# EAGLE schematic plate_template (EAGLE 7.7.0)
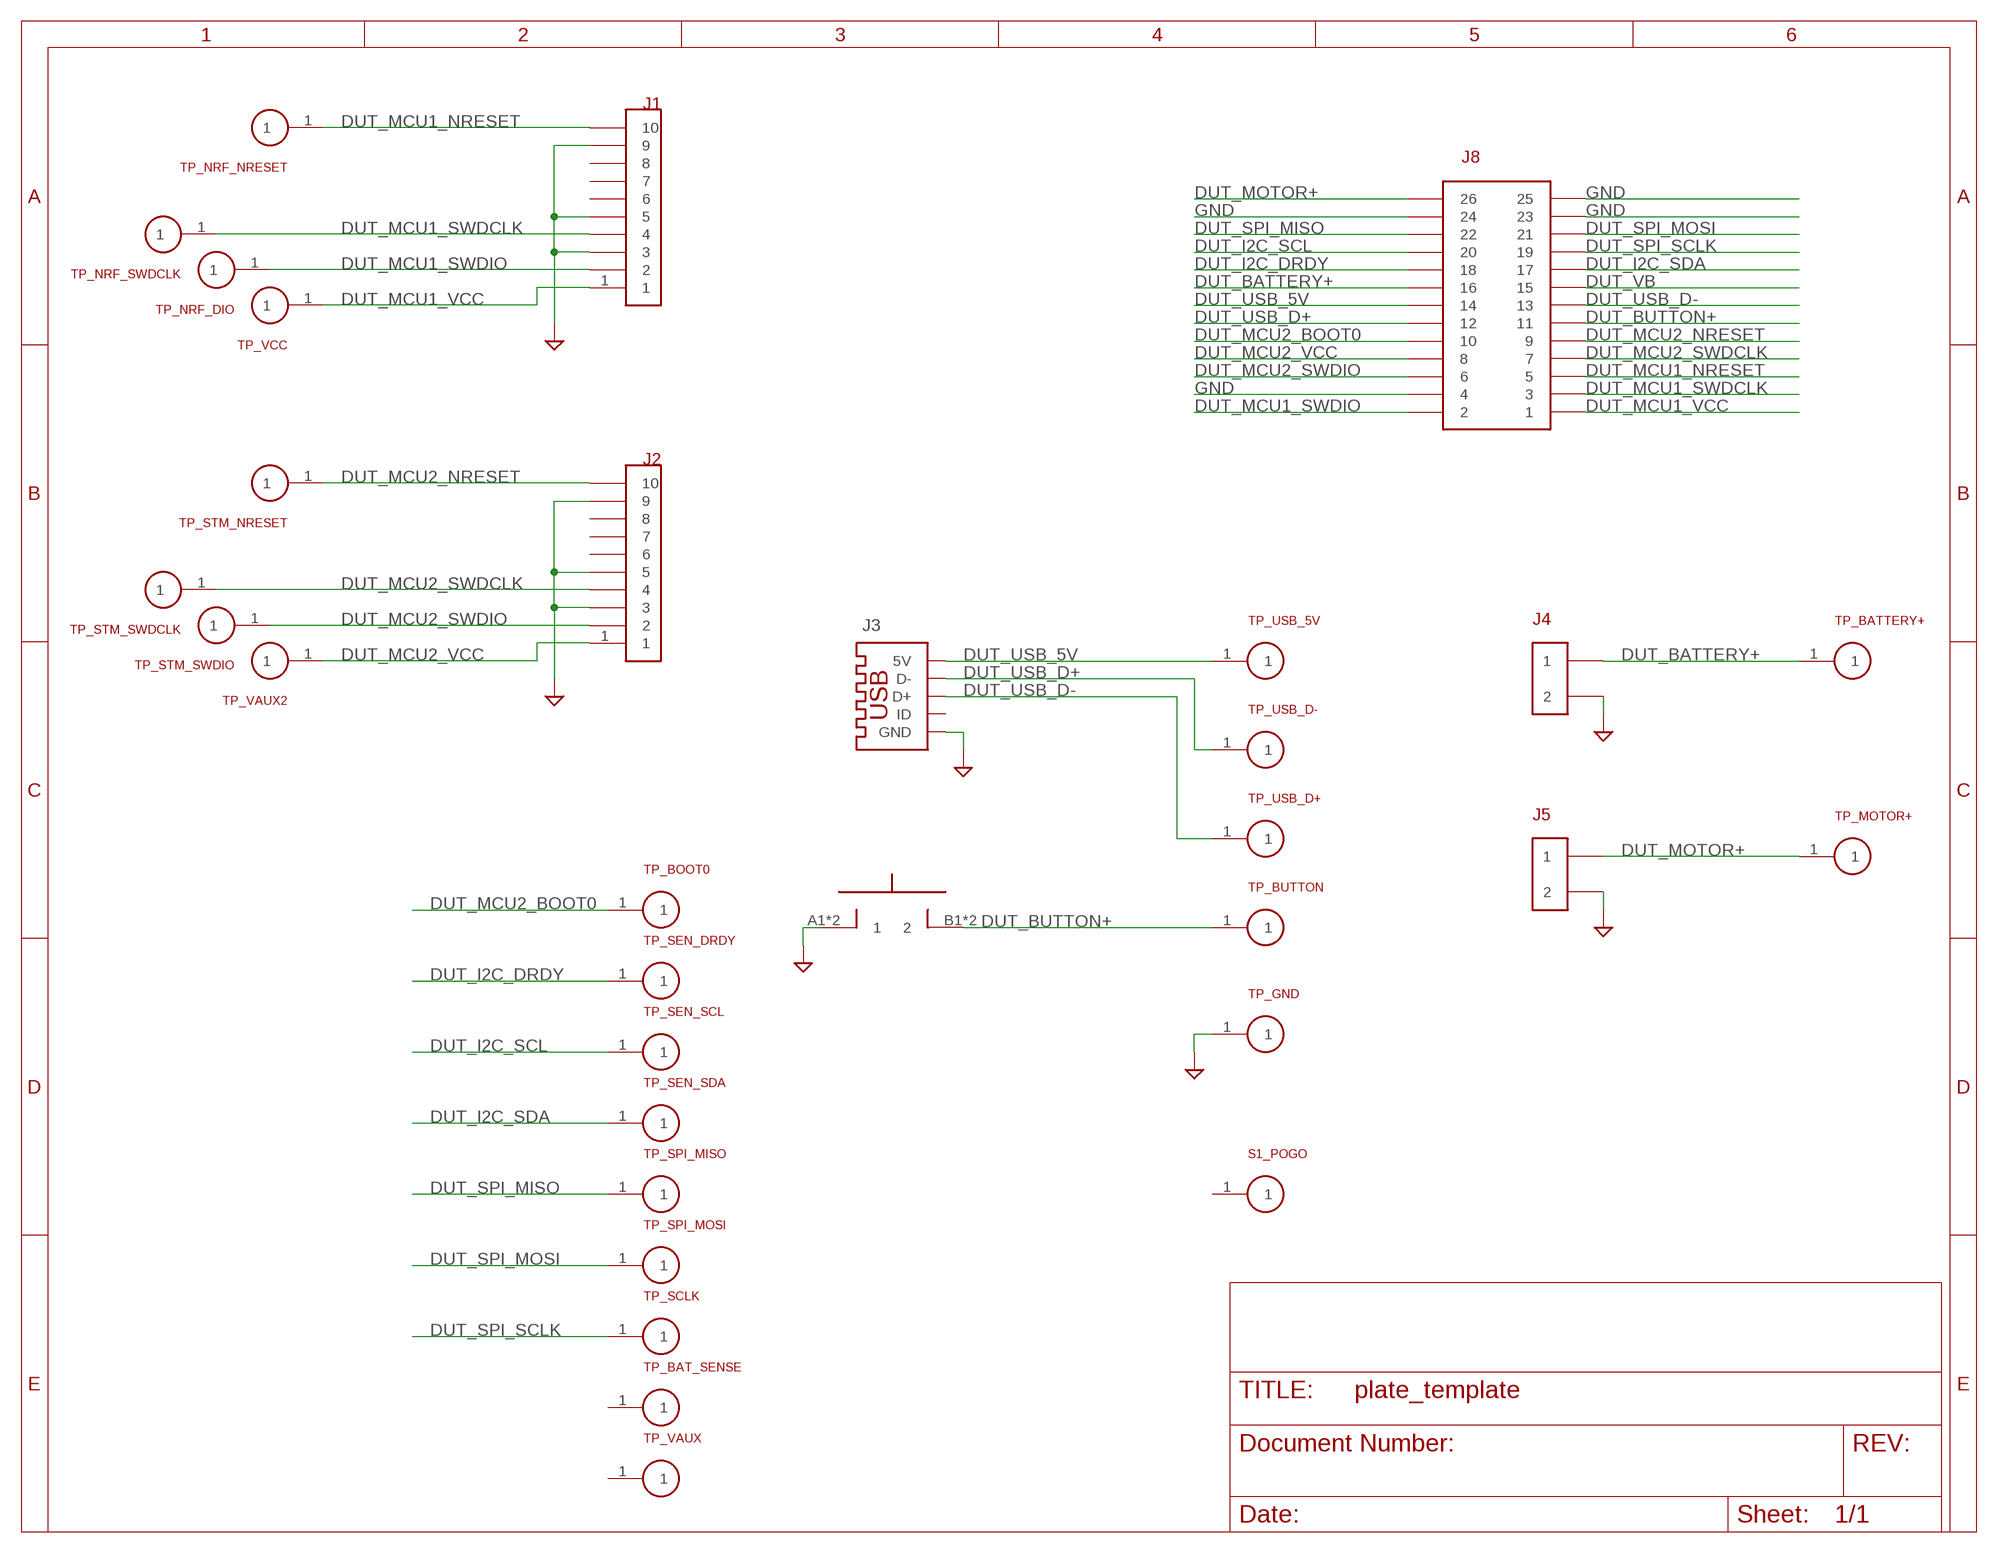
[diagram p0: schematic, sheet 1]

## Parts
J1  CON-10SWD  [SWD-10]
J2  CON-10SWD  [SWD-10]
J3  USB-5PIN10118193  [10118193]
J4  CON-2CON-HEADER-2  [CON-HEADER-2]
J5  CON-2CON-HEADER-2  [CON-HEADER-2]
J8  CON-26  [CON-HEADER-2X13]
S1  SPST-NORACON8  [RACON8]
S1_POGO  TARGET-PINPROBE-0985  [PROBE-0985]
TP_BAT_SENSE  TARGET-PINPROBE-0985  [PROBE-0985]
TP_BATTERY+  TARGET-PINPROBE-0985  [PROBE-0985]
TP_BOOT0  TARGET-PINPROBE-0985  [PROBE-0985]
TP_BUTTON  TARGET-PINPROBE-0985  [PROBE-0985]
TP_GND  TARGET-PINPROBE-0985  [PROBE-0985]
TP_MOTOR+  TARGET-PINPROBE-0985  [PROBE-0985]
TP_NRF_DIO  TARGET-PINPROBE-0985  [PROBE-0985]
TP_NRF_NRESET  TARGET-PINPROBE-0985  [PROBE-0985]
TP_NRF_SWDCLK  TARGET-PINPROBE-0985  [PROBE-0985]
TP_SCLK  TARGET-PINPROBE-0985  [PROBE-0985]
TP_SEN_DRDY  TARGET-PINPROBE-0985  [PROBE-0985]
TP_SEN_SCL  TARGET-PINPROBE-0985  [PROBE-0985]
TP_SEN_SDA  TARGET-PINPROBE-0985  [PROBE-0985]
TP_SPI_MISO  TARGET-PINPROBE-0985  [PROBE-0985]
TP_SPI_MOSI  TARGET-PINPROBE-0985  [PROBE-0985]
TP_STM_NRESET  TARGET-PINPROBE-0985  [PROBE-0985]
TP_STM_SWDCLK  TARGET-PINPROBE-0985  [PROBE-0985]
TP_STM_SWDIO  TARGET-PINPROBE-0985  [PROBE-0985]
TP_USB_5V  TARGET-PINPROBE-0985  [PROBE-0985]
TP_USB_D+  TARGET-PINPROBE-0985  [PROBE-0985]
TP_USB_D-  TARGET-PINPROBE-0985  [PROBE-0985]
TP_VAUX  TARGET-PINPROBE-0985  [PROBE-0985]
TP_VAUX2  TARGET-PINPROBE-0985  [PROBE-0985]
TP_VCC  TARGET-PINPROBE-0985  [PROBE-0985]

## Nets
DUT_BATTERY+: J4.1 J8.16 TP_BATTERY+.1
DUT_BUTTON+: J8.11 S1.B1 S1.B2 TP_BUTTON.1
DUT_I2C_DRDY: J8.18 TP_SEN_DRDY.1
DUT_I2C_SCL: J8.20 TP_SEN_SCL.1
DUT_I2C_SDA: J8.17 TP_SEN_SDA.1
DUT_MCU1_NRESET: J1.10 J8.5 TP_NRF_NRESET.1
DUT_MCU1_SWDCLK: J1.4 J8.3 TP_NRF_SWDCLK.1
DUT_MCU1_SWDIO: J1.2 J8.2 TP_NRF_DIO.1
DUT_MCU1_VCC: J1.1 J8.1 TP_VCC.1
DUT_MCU2_BOOT0: J8.10 TP_BOOT0.1
DUT_MCU2_NRESET: J2.10 J8.9 TP_STM_NRESET.1
DUT_MCU2_SWDCLK: J2.4 J8.7 TP_STM_SWDCLK.1
DUT_MCU2_SWDIO: J2.2 J8.6 TP_STM_SWDIO.1
DUT_MCU2_VCC: J2.1 J8.8 TP_VAUX2.1
DUT_MOTOR+: J5.1 J8.26 TP_MOTOR+.1
DUT_SPI_MISO: J8.22 TP_SPI_MISO.1
DUT_SPI_MOSI: J8.21 TP_SPI_MOSI.1
DUT_SPI_SCLK: J8.19 TP_SCLK.1
DUT_USB_5V: J3.1(5V) J8.14 TP_USB_5V.1
DUT_USB_D+: J3.2(D-) J8.12 TP_USB_D-.1
DUT_USB_D-: J3.3(D+) J8.13 TP_USB_D+.1
DUT_VB: J8.15
GND: J1.3 J1.5 J1.9 J2.3 J2.5 J2.9 J3.5(GND) J4.2 J5.2 J8.4 J8.23 J8.24 J8.25 S1.A1 S1.A2 TP_GND.1
Unconnected: J1.6 J1.7 J1.8 J2.6 J2.7 J2.8 J3.4(ID) S1_POGO.1 TP_BAT_SENSE.1 TP_VAUX.1

## Library data of the parts
J1 J2 = firefly:CON-10; MANUFACTURE: Harwin Inc; ORDERING-CODE: M50-3500542
J3 = firefly:USB-5PIN; MANUFACTURER: Amphenol FCI; ORDERING-CODE: 10118193-0001LF
J4 J5 = firefly:CON-2; MANUFACTURER: FCI; ORDERING-CODE: 20020303-D021B01LF
J8 = firefly:CON-26; MANUFACTURER: Amphenol FCI; ORDERING-CODE: 68602-126HLF
S1 = firefly:SPST-NO; MANUFACTURER: RAFI USA; ORDERING-CODE: 1.14100.5030000
S1_POGO = firefly:TARGET-PIN; POGO_DIAMETER: 1.8
TP_BAT_SENSE TP_BATTERY+ TP_BOOT0 TP_BUTTON TP_GND TP_MOTOR+ TP_NRF_DIO TP_NRF_NRESET TP_NRF_SWDCLK TP_SCLK TP_SEN_DRDY TP_SEN_SCL TP_SEN_SDA TP_SPI_MISO TP_SPI_MOSI TP_STM_NRESET TP_STM_SWDCLK TP_STM_SWDIO TP_USB_5V TP_USB_D+ TP_USB_D- TP_VAUX TP_VAUX2 TP_VCC = firefly:TARGET-PIN